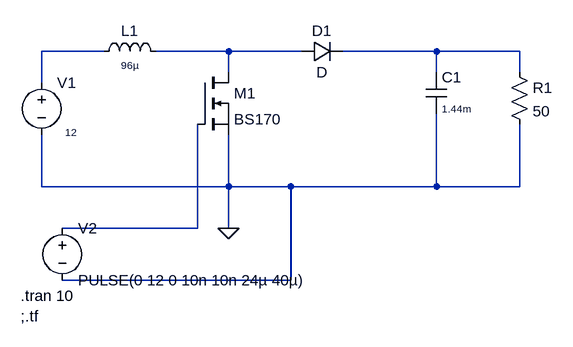
[diagram p0: schematic Boost 12-30.asc]
Boost 12-30.asc, the LTspice schematic file:
Version 4.1
SHEET 1 880 680
WIRE 80 80 -16 80
WIRE 272 80 160 80
WIRE 384 80 272 80
WIRE 592 80 448 80
WIRE 720 80 592 80
WIRE 272 112 272 80
WIRE 592 112 592 80
WIRE 720 112 720 80
WIRE -16 128 -16 80
WIRE -16 288 -16 208
WIRE 272 288 272 208
WIRE 272 288 -16 288
WIRE 368 288 272 288
WIRE 592 288 592 176
WIRE 592 288 368 288
WIRE 720 288 720 192
WIRE 720 288 592 288
WIRE 224 352 224 192
WIRE 224 352 16 352
WIRE 272 352 272 288
WIRE 368 432 368 288
WIRE 368 432 16 432
FLAG 272 352 0
SYMBOL voltage -16 112 R0
WINDOW 3 45 92 Center 1
WINDOW 123 0 0 Left 0
WINDOW 39 0 0 Left 0
SYMATTR InstName V1
SYMATTR Value 12
SYMBOL diode 384 96 R270
WINDOW 0 32 32 VTop 2
WINDOW 3 0 32 VBottom 2
SYMATTR InstName D1
SYMBOL ind 64 96 R270
WINDOW 0 32 56 VTop 2
WINDOW 3 5 56 VBottom 1
SYMATTR InstName L1
SYMATTR Value 96µ
SYMATTR SpiceLine Ipk=7 Rser=0.03 Rpar=30000 Cpar=6.5p
SYMBOL cap 576 112 R0
WINDOW 3 24 56 Left 1
SYMATTR InstName C1
SYMATTR Value 1.44m
SYMBOL res 704 96 R0
SYMATTR InstName R1
SYMATTR Value 50
SYMBOL nmos 224 112 R0
SYMATTR InstName M1
SYMATTR Value BS170
SYMBOL voltage 16 336 R0
WINDOW 123 0 0 Left 0
WINDOW 39 0 0 Left 0
SYMATTR InstName V2
SYMATTR Value PULSE(0 12 0 10n 10n 24µ 40µ)
TEXT -48 456 Left 2 !.tran 10\n;.tf

The netlist it stands for:
* Boost 12-30.asc
V1 N001 0 12
D1 N002 N003 D
L1 N001 N002 96µ Ipk=7 Rser=0.03 Rpar=30000 Cpar=6.5p
C1 N003 0 1.44m
R1 N003 0 50
M1 N002 N004 0 0 BS170
V2 N004 0 PULSE(0 12 0 10n 10n 24µ 40µ)
.model D D
.lib standard.dio
.model NMOS NMOS
.model PMOS PMOS
.lib standard.mos
.tran 10
;.tf
.backanno
.end